# Altium schematic sheet AD7124.SchDoc
size A3
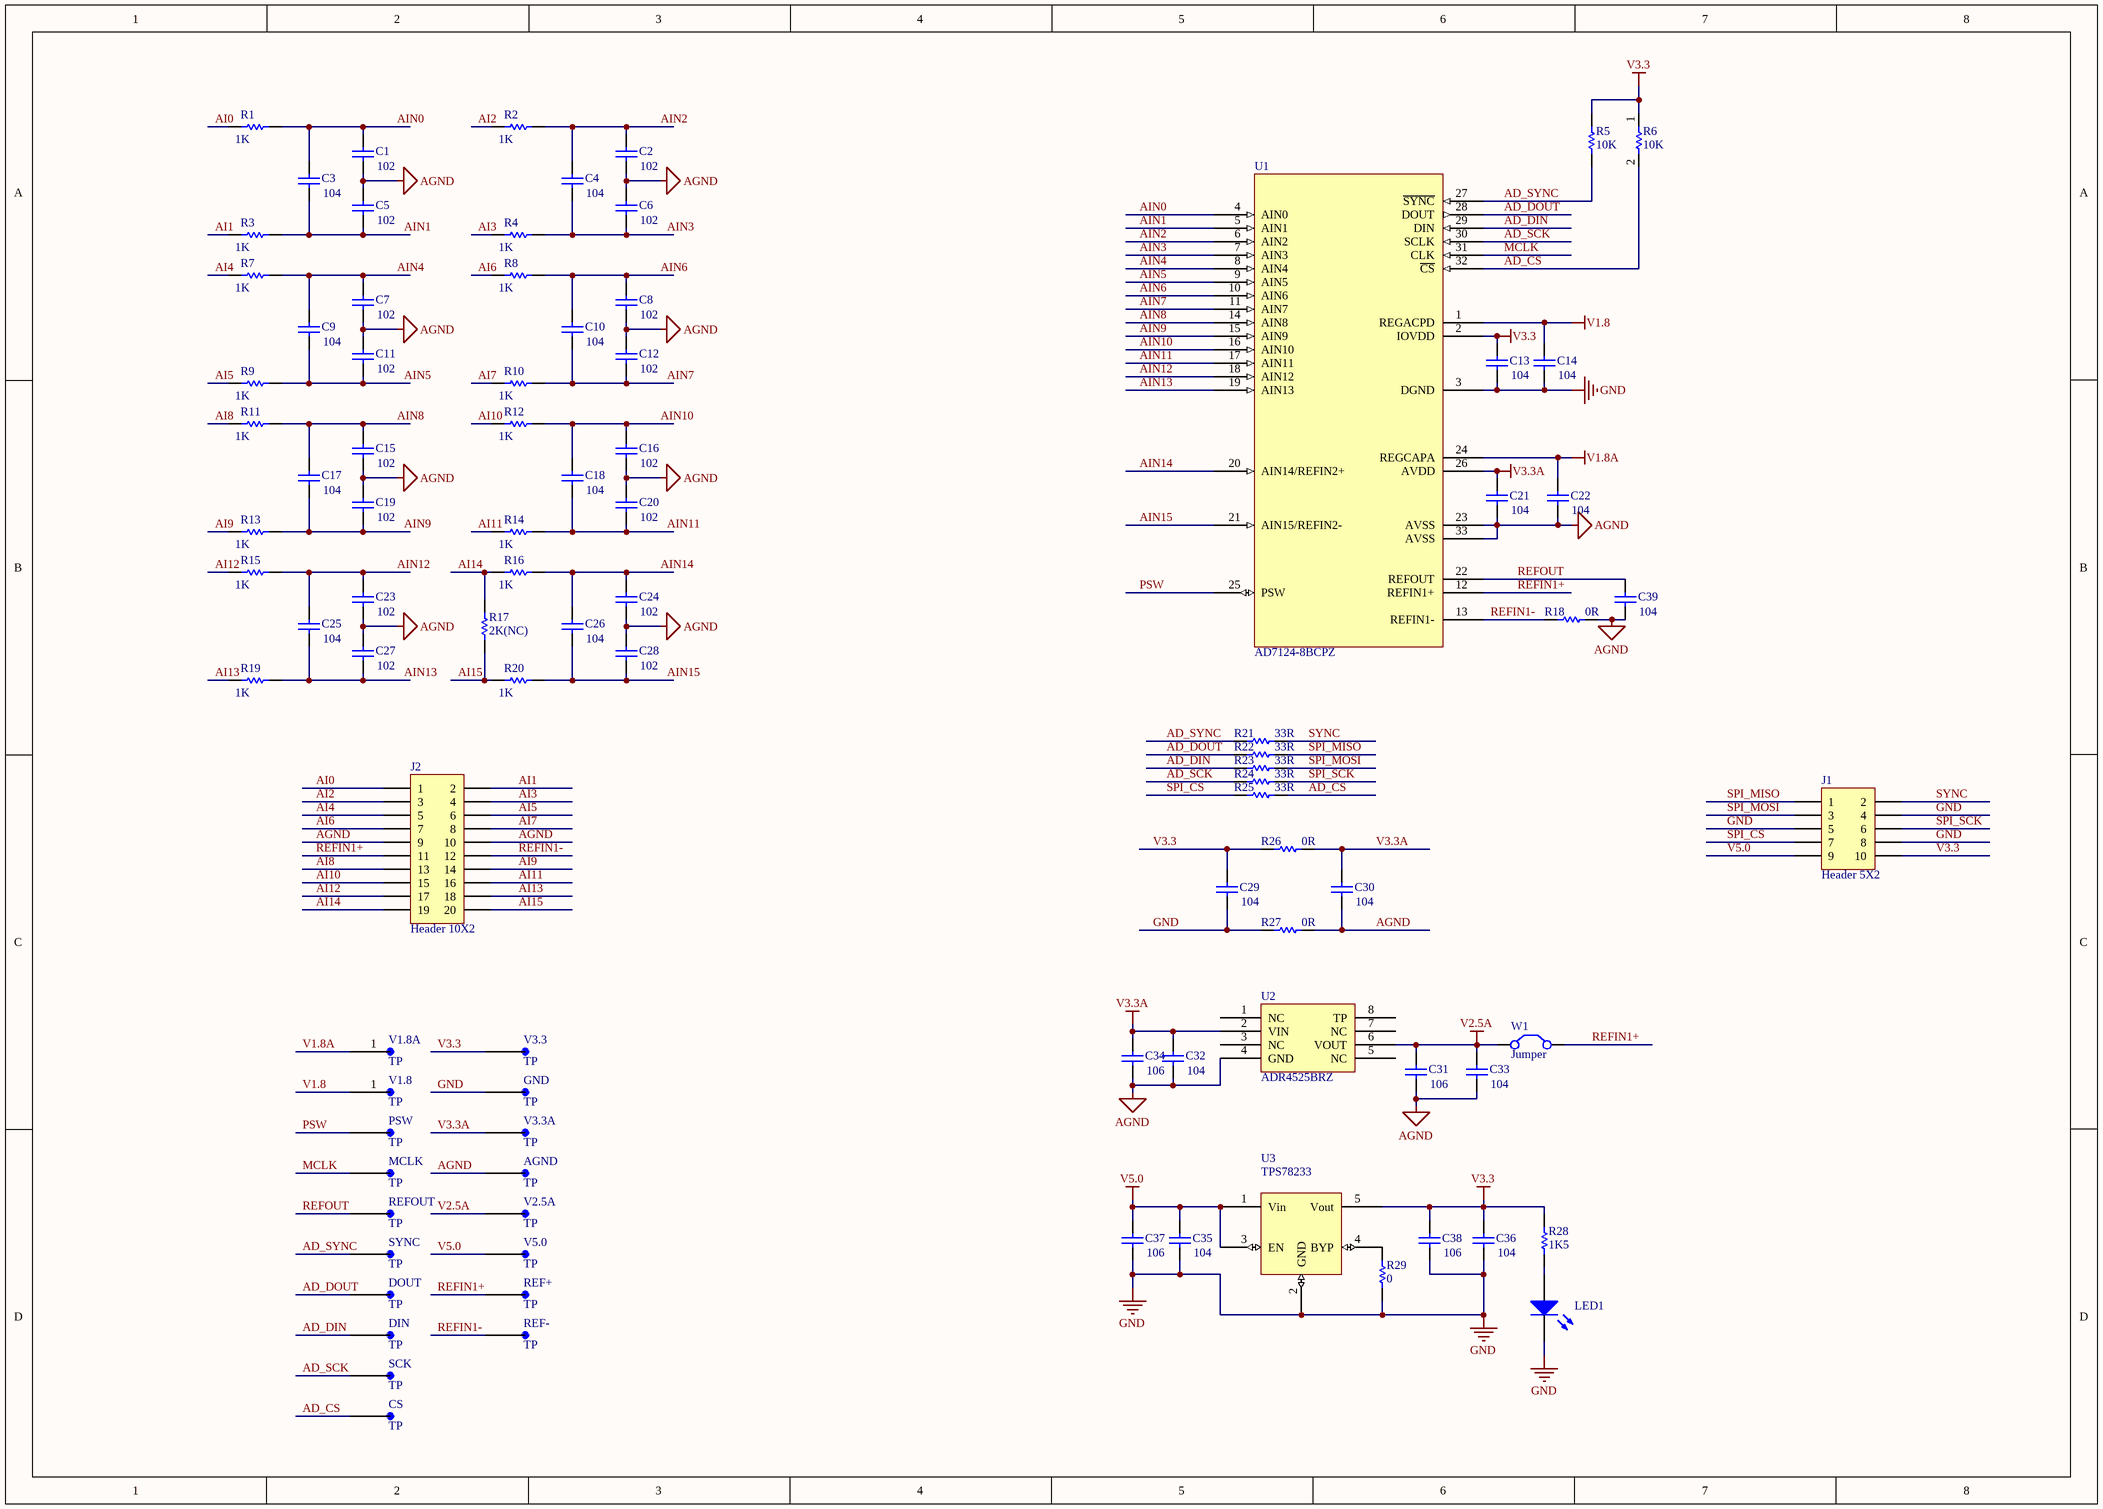
[diagram p0: AD7124.SchDoc]

## Parts
AGND  TP  [TP -DRILL]
C1  value 102  [C0603]  (hidden comment: 15pF)
C2  value 102  [C0603]  (hidden comment: 15pF)
C3  value 104  [C0603]  (hidden comment: 15pF)
C4  value 104  [C0603]  (hidden comment: 15pF)
C5  value 102  [C0603]  (hidden comment: 15pF)
C6  value 102  [C0603]  (hidden comment: 15pF)
C7  value 102  [C0603]  (hidden comment: 15pF)
C8  value 102  [C0603]  (hidden comment: 15pF)
C9  value 104  [C0603]  (hidden comment: 15pF)
C10  value 104  [C0603]  (hidden comment: 15pF)
C11  value 102  [C0603]  (hidden comment: 15pF)
C12  value 102  [C0603]  (hidden comment: 15pF)
C13  value 104  [C0603]  (hidden comment: 15pF)
C14  value 104  [C0603]  (hidden comment: 15pF)
C15  value 102  [C0603]  (hidden comment: 15pF)
C16  value 102  [C0603]  (hidden comment: 15pF)
C17  value 104  [C0603]  (hidden comment: 15pF)
C18  value 104  [C0603]  (hidden comment: 15pF)
C19  value 102  [C0603]  (hidden comment: 15pF)
C20  value 102  [C0603]  (hidden comment: 15pF)
C21  value 104  [C0603]  (hidden comment: 15pF)
C22  value 104  [C0603]  (hidden comment: 15pF)
C23  value 102  [C0603]  (hidden comment: 15pF)
C24  value 102  [C0603]  (hidden comment: 15pF)
C25  value 104  [C0603]  (hidden comment: 15pF)
C26  value 104  [C0603]  (hidden comment: 15pF)
C27  value 102  [C0603]  (hidden comment: 15pF)
C28  value 102  [C0603]  (hidden comment: 15pF)
C29  value 104  [C0603]  (hidden comment: 15pF)
C30  value 104  [C0603]  (hidden comment: 15pF)
C31  value 106  [C1206]  (hidden comment: 15pF)
C32  value 104  [C0603]  (hidden comment: 15pF)
C33  value 104  [C0603]  (hidden comment: 15pF)
C34  value 106  [C1206]  (hidden comment: 15pF)
C35  value 104  [C0603]  (hidden comment: 15pF)
C36  value 104  [C0603]  (hidden comment: 15pF)
C37  value 106  [C1206]  (hidden comment: 15pF)
C38  value 106  [C1206]  (hidden comment: 15pF)
C39  value 104  [C0603]  (hidden comment: 15pF)
CS  TP  [TP -DRILL]
DIN  TP  [TP -DRILL]
DOUT  TP  [TP -DRILL]
GND  TP  [TP -DRILL]
J1  Header 5X2  [IDC10M]
J2  Header 10X2  [IDC20M]
LED1  LED1  [D0805]  (value not drawn)
MCLK  TP  [TP -DRILL]
PSW  TP  [TP -DRILL]
R1  1K  [R0603]
R2  1K  [R0603]
R3  1K  [R0603]
R4  1K  [R0603]
R5  10K  [R0603]
R6  10K  [R0603]
R7  1K  [R0603]
R8  1K  [R0603]
R9  1K  [R0603]
R10  1K  [R0603]
R11  1K  [R0603]
R12  1K  [R0603]
R13  1K  [R0603]
R14  1K  [R0603]
R15  1K  [R0603]
R16  1K  [R0603]
R17  2K(NC)  [R1206]
R18  0R  [R1206]
R19  1K  [R0603]
R20  1K  [R0603]
R21  33R  [R0603]
R22  33R  [R0603]
R23  33R  [R0603]
R24  33R  [R0603]
R25  33R  [R0603]
R26  0R  [R1206]
R27  0R  [R1206]
R28  1K5  [R0603]
R29  0  [R0603]
REF+  TP  [TP -DRILL]
REF-  TP  [TP -DRILL]
REFOUT  TP  [TP -DRILL]
SCK  TP  [TP -DRILL]
SYNC  TP  [TP -DRILL]
U1  AD7124-8BCPZ  [QFN32]
U2  ADR4525BRZ  [SO-8]
U3  TPS78233  [SOT-23-5]
V1.8  TP  [TP -DRILL]
V1.8A  TP  [TP -DRILL]
V2.5A  TP  [TP -DRILL]
V3.3  TP  [TP -DRILL]
V3.3A  TP  [TP -DRILL]
V5.0  TP  [TP -DRILL]
W1  Jumper  [HDR1X2]

## Nets
AGND: AGND.1 C1.1 C2.1 C5.2 C6.2 C7.1 C8.1 C11.2 C12.2 C15.1 C16.1 C19.2 C20.2 C21.1 C22.1 C23.1 C24.1 C27.2 C28.2 C30.1 C31.1 C32.1 C33.1 C34.1 C39.1 J2.9 J2.10 R18.1 R27.1 U1.23(AVSS) U1.33(AVSS) U2.4(GND)
GND: C13.1 C14.1 C29.1 C35.1 C36.1 C37.1 C38.1 GND.1 J1.4 J1.5 J1.8 LED1.2(K) R27.2 R29.1 U1.3(DGND) U3.2(GND)
V1.8: C14.2 U1.1(REGACPD) V1.8.1
V1.8A: C22.2 U1.24(REGCAPA) V1.8A.1
V2.5A: C31.2 C33.2 U2.6(VOUT) V2.5A.1 W1.1(C1)
V3.3: C13.2 C29.2 C36.2 C38.2 J1.10 R5.1 R6.1 R26.2 R28.2 U1.2(IOVDD) U3.5(Vout) V3.3.1
V3.3A: C21.2 C30.2 C32.2 C34.2 R26.1 U1.26(AVDD) U2.2(VIN) V3.3A.1
V5.0: C35.2 C37.2 J1.9 U3.1(Vin) U3.3(EN) V5.0.1
AD_CS: CS.1 R6.2 R25.2 U1.32(~{CS})
AD_DIN: DIN.1 R23.2 U1.29(DIN)
AD_DOUT: DOUT.1 R22.2 U1.28(DOUT)
AD_SCK: R24.2 SCK.1 U1.30(SCLK)
AD_SYNC: R5.2 R21.2 SYNC.1 U1.27(~{SYNC})
AI0: J2.1 R1.2
AI1: J2.2 R3.2
AI2: J2.3 R2.2
AI3: J2.4 R4.2
AI4: J2.5 R7.2
AI5: J2.6 R9.2
AI6: J2.7 R8.2
AI7: J2.8 R10.2
AI8: J2.13 R11.2
AI9: J2.14 R13.2
AI10: J2.15 R12.2
AI11: J2.16 R14.2
AI12: J2.17 R15.2
AI13: J2.18 R19.2
AI14: J2.19 R16.2 R17.1
AI15: J2.20 R17.2 R20.2
AIN0: C1.2 C3.2 R1.1 U1.4(AIN0)
AIN1: C3.1 C5.1 R3.1 U1.5(AIN1)
AIN2: C2.2 C4.2 R2.1 U1.6(AIN2)
AIN3: C4.1 C6.1 R4.1 U1.7(AIN3)
AIN4: C7.2 C9.2 R7.1 U1.8(AIN4)
AIN5: C9.1 C11.1 R9.1 U1.9(AIN5)
AIN6: C8.2 C10.2 R8.1 U1.10(AIN6)
AIN7: C10.1 C12.1 R10.1 U1.11(AIN7)
AIN8: C15.2 C17.2 R11.1 U1.14(AIN8)
AIN9: C17.1 C19.1 R13.1 U1.15(AIN9)
AIN10: C16.2 C18.2 R12.1 U1.16(AIN10)
AIN11: C18.1 C20.1 R14.1 U1.17(AIN11)
AIN12: C23.2 C25.2 R15.1 U1.18(AIN12)
AIN13: C25.1 C27.1 R19.1 U1.19(AIN13)
AIN14: C24.2 C26.2 R16.1 U1.20(AIN14/REFIN2+)
AIN15: C26.1 C28.1 R20.1 U1.21(AIN15/REFIN2-)
MCLK: MCLK.1 U1.31(CLK)
PSW: PSW.1 U1.25(PSW)
REFIN1+: J2.11 REF+.1 U1.12(REFIN1+) W1.2(C2)
REFIN1-: J2.12 R18.2 REF-.1 U1.13(REFIN1-)
REFOUT: C39.2 REFOUT.1 U1.22(REFOUT)
SPI_CS: J1.7 R25.1
SPI_MISO: J1.1 R22.1
SPI_MOSI: J1.3 R23.1
SPI_SCK: J1.6 R24.1
SYNC: J1.2 R21.1
NetLED1_1: LED1.1(A) R28.1
NetR29_2: R29.2 U3.4(BYP)

Not connected (* = marked no-connect by the designer): U2 1(NC) 3(NC) 5(NC) 7(NC) 8(TP)

## Library data of the parts
AGND CS DIN DOUT GND MCLK PSW REF+ REF- REFOUT SCK SYNC V1.8 V1.8A V2.5A V3.3 V3.3A V5.0 = Single_Hole
C1-C39 = Cap: Capacitor; Published: 8-Jun-2000; LatestRevisionDate: 17-Jul-2002; LatestRevisionNote: Re-released for DXP Platform.; PackageReference: RAD-0.3; Publisher: Altium Limited; PackageDescription: Radial Cap, Thru-Hole; 2 Leads; 0.3 in Pin Spacing
J1 = Header 5X2: Header, 5-Pin, Dual row; LatestRevisionDate: 17-Jul-2002; LatestRevisionNote: Re-released for DXP Platform.; Publisher: Altium Limited
J2 = Header 10X2: Header, 10-Pin, Dual row; LatestRevisionDate: 17-Jul-2002; LatestRevisionNote: Re-released for DXP Platform.; Publisher: Altium Limited
LED1 = LED2: Typical RED, GREEN, YELLOW, AMBER GaAs LED; Published: 8-Jun-2000; LatestRevisionDate: 17-Jul-2002; LatestRevisionNote: Re-released for DXP Platform.; PackageVersion: Feb-2002; PackageReference: 3.2X1.6X1.1; Publisher: Altium Limited; PackageDescription: SM LED; 2 Flat Leads
R1-R29 = Res1: Resistor; Published: 8-Jun-2000; LatestRevisionDate: 17-Jul-2002; LatestRevisionNote: Re-released for DXP Platform.; PackageReference: AXIAL-0.3; Publisher: Altium Limited; PackageDescription: Axial Device, Thru-Hole; 2 Leads; 0.3 in Pin Spacing
  R1-R4 R7-R16 R19 R20: Value: 1K
  R5 R6: Value: 10K
  R17: Value: 2K(NC)
  R18 R26 R27: Value: 0R
  R21-R25: Value: 33R
  R28: Value: 1K5
  R29: Value: 0
U3 = CAT6219-330
W1 = Jumper: Jumper Wire; Published: 24-Mar-1999; LatestRevisionDate: 17-Jul-2002; LatestRevisionNote: Re-released for DXP Platform.; PackageReference: RAD-0.2; Publisher: Altium Limited; PackageDescription: Radial Cap, Thru-Hole; 2 Leads; 0.2 in Pin Spacing